# EAGLE design sensors_board (EAGLE 7.7.0)
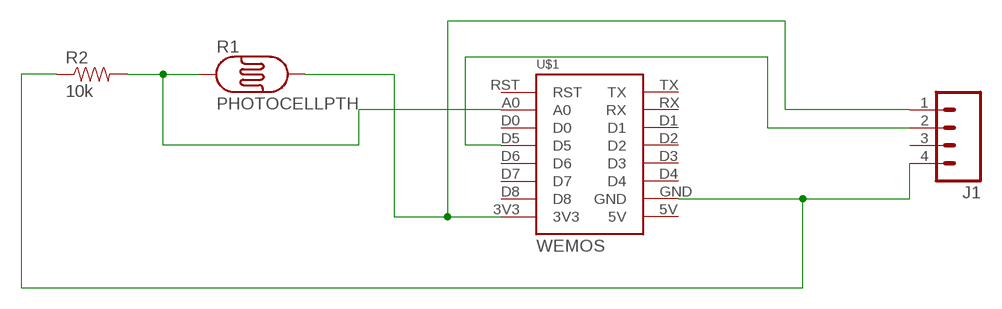
[diagram p0: schematic, sheet 1]

## Parts
J1  M04PTH  [1X04]
R1  PHOTOCELLPTH  [PHOTOCELL]
R2  10k  10KOHM-1/4W-1%(PTH)HORIZ  [AXIAL-0.3]
U$1  WEMOS  [WEMOS]

## Nets
N$1: J1.4 R2.P$1 U$1.GND
N$2: J1.1 R1.2 U$1.3V3
N$3: J1.2 U$1.D5
N$6: R1.1 R2.P$2 U$1.A0
Unconnected: J1.3 U$1.5V U$1.D0 U$1.D1 U$1.D2 U$1.D3 U$1.D4 U$1.D6 U$1.D7 U$1.D8 U$1.RST U$1.RX U$1.TX

## Library data of the parts
J1 = SparkFun-Connectors:M04: Header 4 Standard 4-pin 0.1" header. Use with straight break away headers (SKU : PRT-00116), right angle break away headers (PRT-00553), swiss pins (PRT-00743), machine pins (PRT-00117), and female headers (PRT-00115). Molex polarized connector foot print use with SKU : PRT-08231 with associated crimp pins and housings. 1MM SMD Version SKU: PRT-10208; PROD_ID: CONN-09696
R1 = SparkFun-Sensors:PHOTOCELL: CdS photoresistor. This is a low cost way to detect light levels. Resistance decreases with more incoming light. SparkFun SKU: SEN-09088
R2 = SparkFun-Resistors:10KOHM-1/4W-1%(PTH): RES-12183; PROD_ID: RES-12183
U$1 = 1455413453956-wemos:WEMOS

## Board
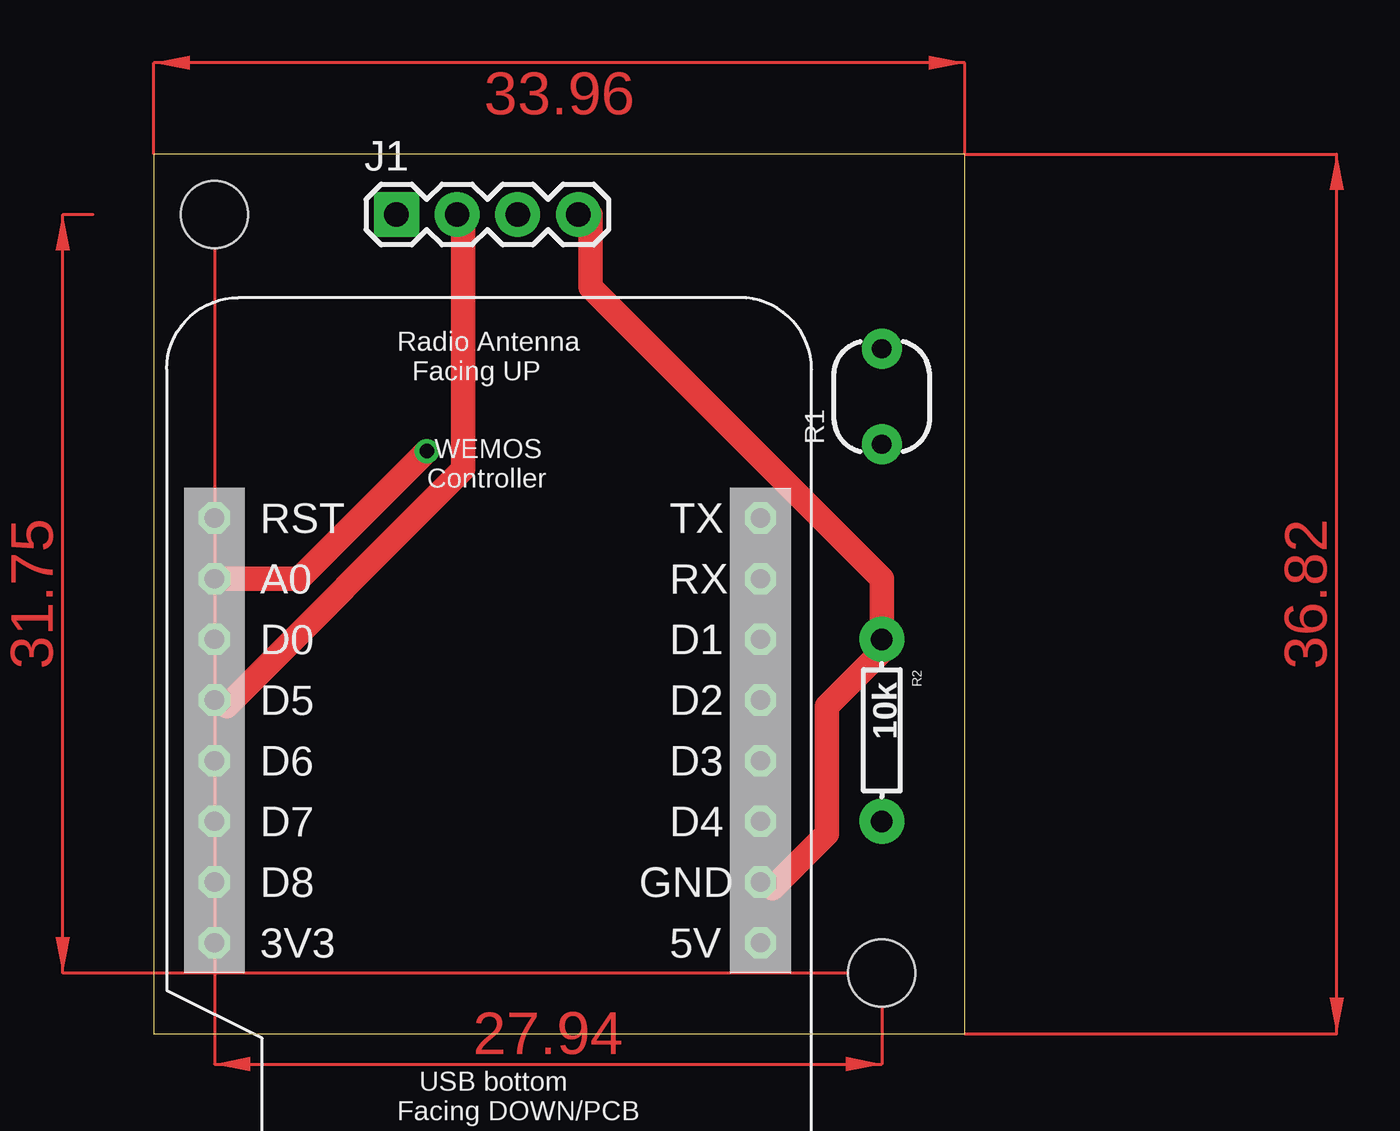
[diagram p1: board, top side]
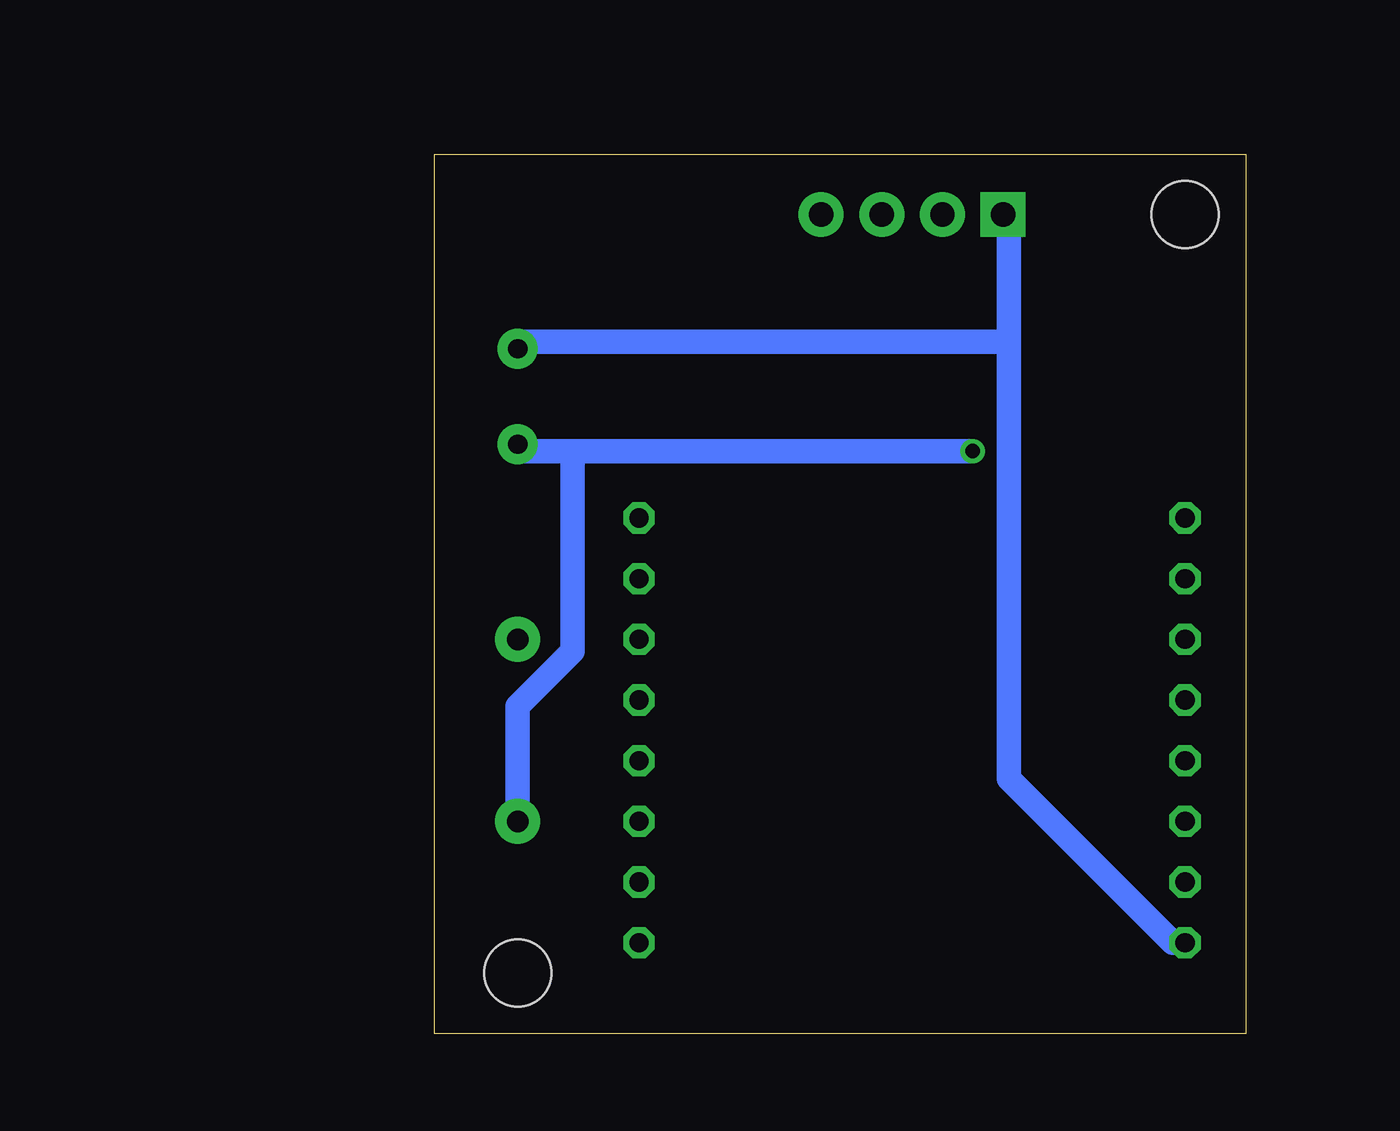
[diagram p2: board, bottom side, seen from below]

Size 33.96 x 36.82 mm. Coordinates in mm from the lower left corner, seen from the top.
Outline: 0,0 33.96,0 33.96,36.82 0,36.82 0,0
Copper layers (1*16): Top 0.035mm / dielectric 1.5mm / Bottom 0.035mm
Design rules "default *": minimum track width 40mil, minimum drill 24mil, track to track 20mil, track to pad 20mil, pad to pad 20mil, via to via 20mil, smd to smd 20mil, copper to edge 40mil, drill to drill 8mil, minimum pad ring 10mil, minimum via ring 8mil, stop-mask expansion 4mil, vias tented up to drill 0mil, thermal gap 10mil
Holes 2.8 mm at 2.54,34.29 30.48,2.54

### Footprints (pad centres in the part's own frame; a part is rotated, then mirrored left to right if it is on the bottom)
1X04 = drill 1.016 pad 1.88 square: 1 0,0 | drill 1.016 pad 1.88: 2 2.54,0; 3 5.08,0; 4 7.62,0
PHOTOCELL = drill 0.8 pad 1.676: 1 -2,0; 2 2,0
AXIAL-0.3 = drill 0.9 pad 1.88: P$1 -3.81,0; P$2 3.81,0
WEMOS = drill 0.8 octagon: 3V3 0,0; 5V 22.86,0; A0 0,15.24; D0 0,12.7; D1 22.86,12.7; D2 22.86,10.16; D3 22.86,7.62; D4 22.86,5.08; D5 0,10.16; D6 0,7.62; D7 0,5.08; D8 0,2.54; GND 22.86,2.54; RST 0,17.78; RX 22.86,15.24; TX 22.86,17.78

### Placement (x,y rotation side)
J1  10.16,34.29 0 top
R1  30.48,26.67 90 top
R2  30.48,12.7 270 top
U$1  2.54,3.81 0 top

### Tracks (layer width: path | path; a pad name or v marks a point on that pad's centre or on a via)
N$1
  Top 1.016: U$1.GND 25.91,6.1 28.19,8.38 28.19,13.72 30.48,16 R2.P$1 30.48,19.05 18.29,31.24 18.29,34.29 J1.4
N$2
  Bottom 1.016: 9.91,28.96 9.91,34.29 J1.1 | 9.91,28.96 9.91,10.67 3.05,3.81 U$1.3V3 | 9.91,28.96 30.48,28.96 R1.2
N$3
  Top 1.016: U$1.D5 3.05,13.72 12.95,23.62 12.95,34.29 J1.2
N$6  (via drill 0.61)
  Top 1.016: U$1.A0 6.1,19.05 v11.43,24.38
  Bottom 1.016: 28.19,24.38 30.48,24.38 R1.1 | 28.19,24.38 v11.43,24.38 | R2.P$2 30.48,13.72 28.19,16 28.19,24.38
(copper drawn outside any net)
  shapes: Top area x6